# EAGLE schematic Atmoscan-ng (EAGLE 7.5.0)
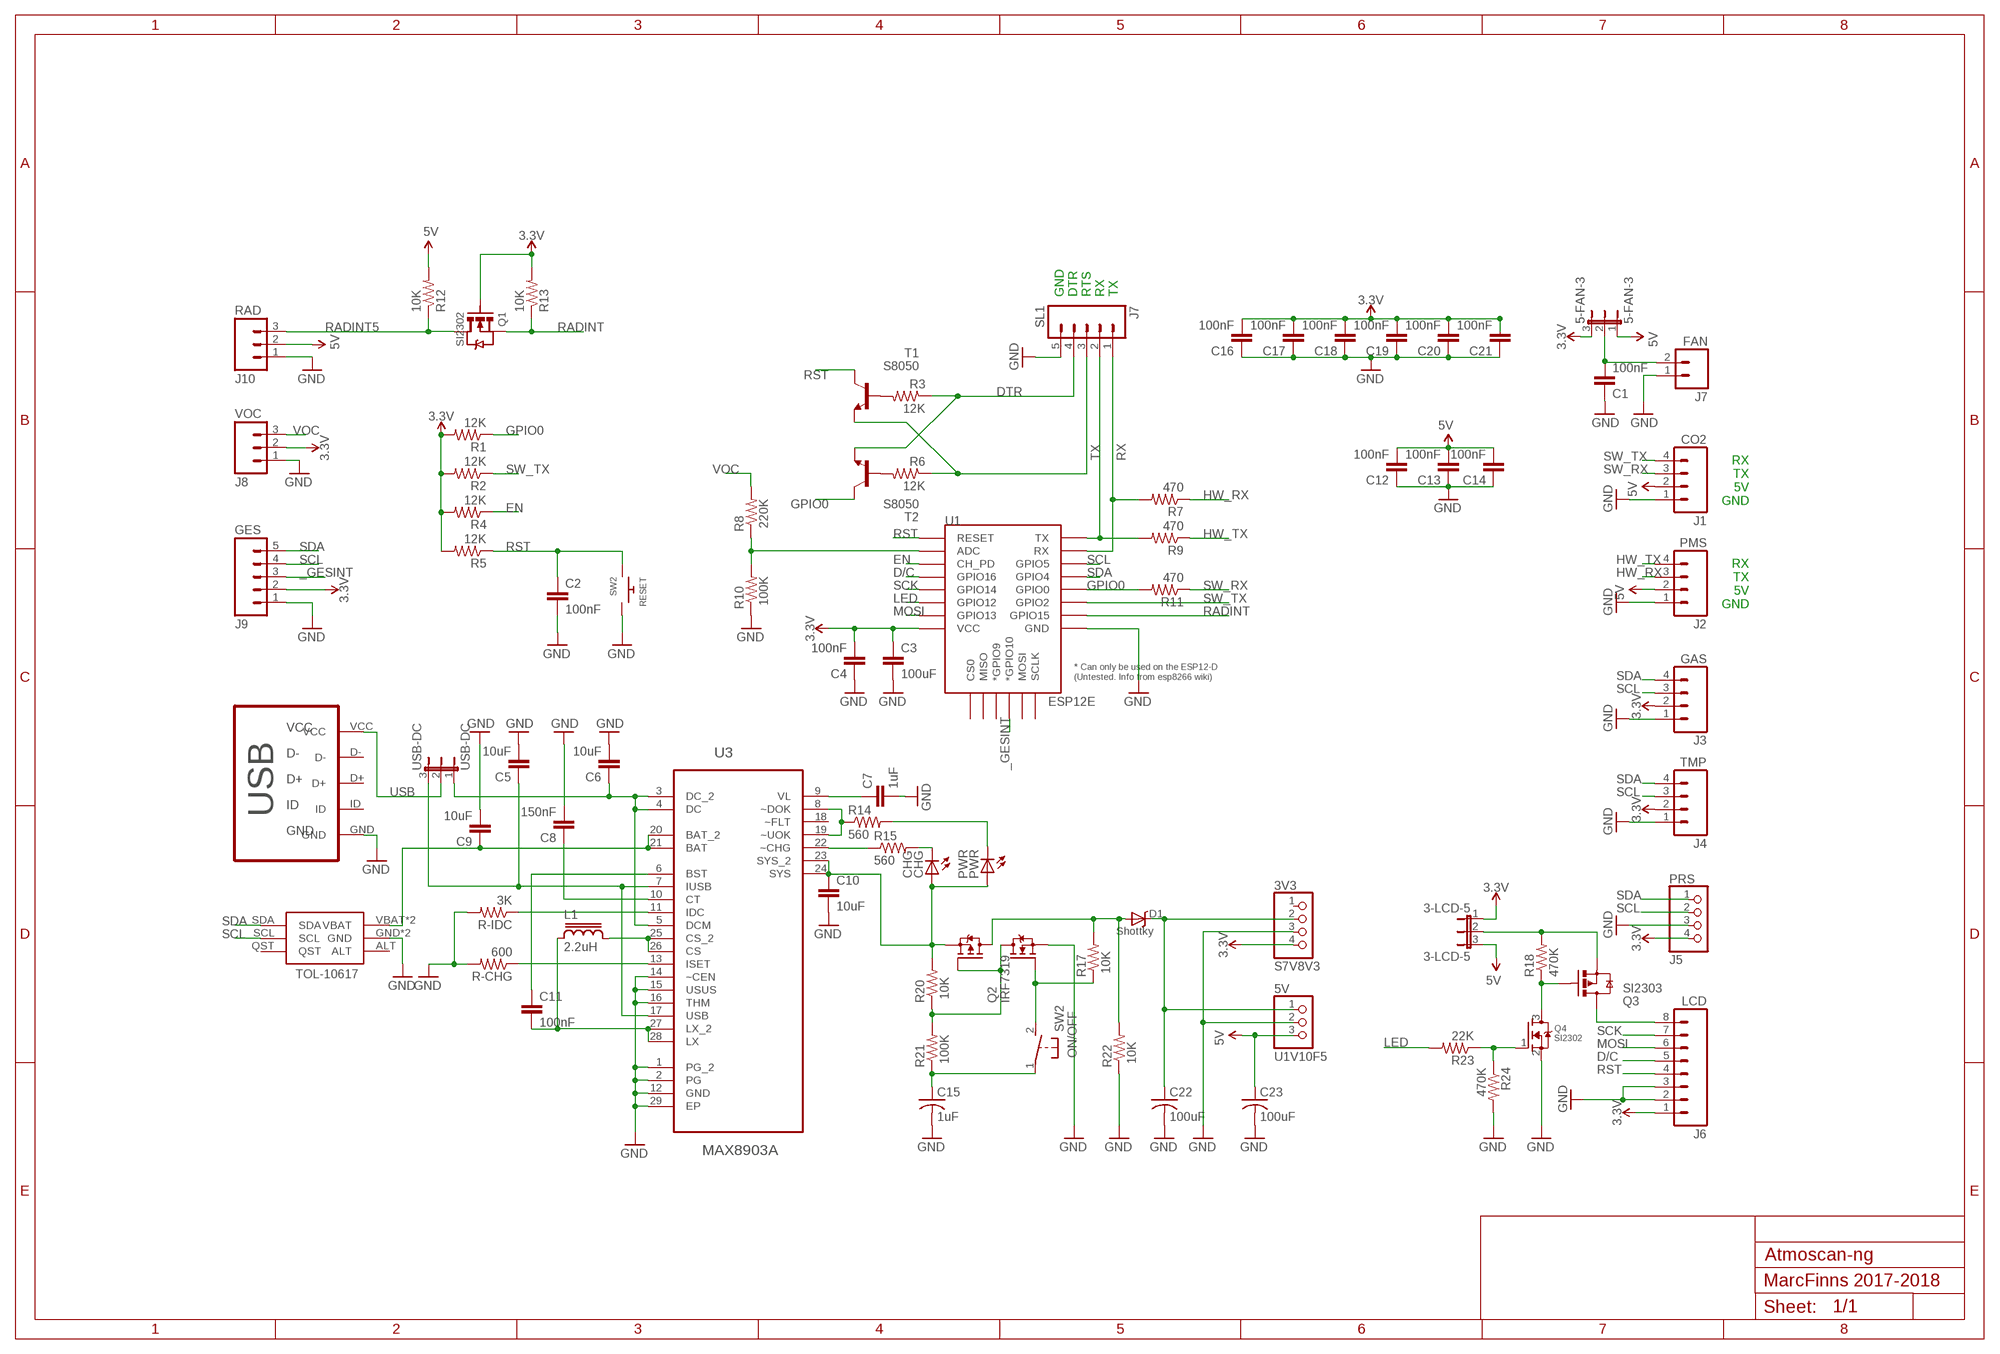
[diagram p0: schematic, sheet 1]

## Parts
3-LCD-5  3-LCD-5  JP2E  [JP2]
3V3  S7V8V3  PINHD-1X4  [1X04]
5-FAN-3  5-FAN-3  JP2E  [JP2]
5V  U1V10F5  PINHD-1X3  [1X03]
C1  100nF  C-EUC0805  [C0805]
C2  100nF  C-EUC0805  [C0805]
C3  100uF  C-EUC0805  [C0805]
C4  100nF  C-EUC0805  [C0805]
C5  10uF  C-EUC0805  [C0805]
C6  10uF  C-EUC0805  [C0805]
C7  1uF  C-EUC0805  [C0805]
C8  150nF  C-EUC0805  [C0805]
C9  10uF  C-EUC0805  [C0805]
C10  10uF  C-EUC0805  [C0805]
C11  100nF  C-EUC0805  [C0805]
C12  100nF  C-EUC0805  [C0805]
C13  100nF  C-EUC0805  [C0805]
C14  100nF  C-EUC0805  [C0805]
C15  1uF  C-USC0805K  [C0805K]
C16  100nF  C-EUC0805  [C0805]
C17  100nF  C-EUC0805  [C0805]
C18  100nF  C-EUC0805  [C0805]
C19  100nF  C-EUC0805  [C0805]
C20  100nF  C-EUC0805  [C0805]
C21  100nF  C-EUC0805  [C0805]
C22  100uF  C-USC0805K  [C0805K]
C23  100uF  C-USC0805K  [C0805K]
CHG  CHG  LEDCHIPLED_0805  [CHIPLED_0805]
CO2  J1  M04  [04P]
D1  Shottky  DIODE-SCHOTTKYSMA-403D  [SMA-403D]
FAN  J7  M02  [02P]
GAS  J3  M04  [04P]
GES  J9  M05  [05P]
L1  2.2uH  SDR0503  [SDR0503]
LCD  J6  M08  [08P]
ON/OFF  SW2  31-XX  [B3F-31XX]
PMS  J2  M04  [04P]
PRS  J5  PINHD-1X4  [1X04]
PWR  PWR  LEDCHIPLED_0805  [CHIPLED_0805]
Q1  SI2302  FET-NMOS-BSS138  [SOT-23]
Q2  IRF7319  [SO08-IRF]
Q3  SI2303  NX3008PBK  [SOT23-3]
Q4  SI2302  MOSFET-NREFLOW  [SOT23]
R1  12K  R-US_M0805  [M0805]
R2  12K  R-US_M0805  [M0805]
R3  12K  R-US_M0805  [M0805]
R4  12K  R-US_M0805  [M0805]
R5  12K  R-US_M0805  [M0805]
R6  12K  R-US_M0805  [M0805]
R7  470  R-US_M0805  [M0805]
R8  220K  R-US_M0805  [M0805]
R9  470  R-US_M0805  [M0805]
R10  100K  R-US_M0805  [M0805]
R11  470  R-US_M0805  [M0805]
R12  10K  R-US_M0805  [M0805]
R13  10K  R-US_M0805  [M0805]
R14  560  R-US_M0805  [M0805]
R15  560  R-US_M0805  [M0805]
R17  10K  R-US_M0805  [M0805]
R18  470K  R-US_M0805  [M0805]
R20  10K  R-US_M0805  [M0805]
R21  100K  R-US_M0805  [M0805]
R22  10K  R-US_M0805  [M0805]
R23  22K  R-US_M0805  [M0805]
R24  470K  R-US_M0805  [M0805]
R-CHG  600  R-US_M0805  [M0805]
R-IDC  3K  R-US_M0805  [M0805]
RAD  J10  M03  [03P]
RESET  SW2  SWITCH_PUSHBUTTONC&K_KSS  [BTN_CK_KSS]
SL1  J7  M05  [05P]
T1  S8050  BC846  [SOT23]
T2  S8050  BC846  [SOT23]
TMP  J4  M04  [04P]
U1  ESP12E  ESP12ESMD  [ESP12E-SMD]
U2  TOL-10617  [TOL-10617]
U3  MAX8903A  MAX8903AETI+  [QFN40P400X400X80-29N]
USB  MICRO-USB-B  [MICRO_USB_4_LEGS]
USB-DC  USB-DC  JP2E  [JP2]
VOC  J8  M03  [03P]

## Nets
3.3V: 3-LCD-5.1 3V3.4 5-FAN-3.3 C3.1 C4.2 C16.2 C17.2 C18.2 C19.2 C20.2 C21.2 GAS.2 GES.2 LCD.1 PRS.4 Q1.1(G) R1.2 R2.2 R4.2 R5.2 R13.2 TMP.2 U1.VCC VOC.2
5V: 3-LCD-5.3 5-FAN-3.1 5V.3 C12.2 C13.2 C14.2 C23.1 CO2.2 PMS.2 R12.2 RAD.2
_GESINT: GES.3 U1.GPIO10(*GPIO10)
ADC: R8.1 R10.2 U1.ADC
D/C: LCD.5 U1.GPIO16
DTR: R3.1 SL1.4 T2.2(E)
EN: R4.1 U1.CH_PD
GND: 3V3.3 5V.2 C1.1 C2.2 C3.2 C4.1 C5.2 C6.2 C7.2 C8.2 C9.2 C10.2 C12.1 C13.1 C14.1 C15.2 C16.1 C17.1 C18.1 C19.1 C20.1 C21.1 C22.2 C23.2 CO2.1 FAN.1 GAS.1 GES.1 LCD.2 LCD.3 PMS.1 PRS.3 Q2.1(N-S) Q4.2(S) R10.1 R22.1 R24.2 R-CHG.2 R-IDC.2 RAD.1 RESET.P$2 SL1.5 TMP.1 U1.GND U2.GND U2.GND1(GND) U3.1(PG_2) U3.2(PG) U3.12(GND) U3.14(~CEN) U3.15(USUS) U3.16(THM) U3.29(EP) USB.GND VOC.1
GPIO0: R1.1 R11.2 T2.3(C) U1.GPIO0
HW_RX: PMS.3 R7.1
HW_TX: PMS.4 R9.1
LED: R23.2 U1.GPIO12
MOSI: LCD.6 U1.GPIO13
N$1 [power]: 3-LCD-5.2 Q3.2(S) R18.2
N$3 [hipower]: LCD.8 Q3.3(D)
N$4: C15.1 ON/OFF.1(P) R21.1
N$5: C11.2 L1.1 U3.27(LX_2) U3.28(LX)
N$6: C11.1 U3.6(BST)
N$7: C8.1 U3.10(CT)
N$8: Q3.1(G) Q4.3(D) R18.1
N$9: R14.1 U3.8(~DOK) U3.19(~UOK)
N$10: C7.1 U3.9(VL)
N$11: R6.2 T2.1(B)
N$12 [hipower]: D1.A Q2.5(P-D) Q2.6(P-D) R17.2 R22.2
N$13: ON/OFF.2(S) Q2.2(N-G) R17.1
N$14: Q4.1(G) R23.1 R24.1
N$15: R15.1 U3.22(~CHG)
N$16: PWR.C R14.2
N$17: CHG.C R15.2
N$18: L1.2 U3.25(CS_2) U3.26(CS)
N$19: R-CHG.1 U3.13(ISET)
N$20: R-IDC.1 U3.11(IDC)
N$22: R3.2 T1.1(B)
N$23: 5-FAN-3.2 C1.2 FAN.2
N$26: Q2.4(P-G) Q2.7(N-D) Q2.8(N-D) R20.1 R21.2
RADINT: Q1.2(S) R13.1 U1.GPIO15
RADINT5: Q1.3(D) R12.1 RAD.3
RST: C2.1 LCD.4 R5.1 RESET.P$1 T1.3(C) U1.RESET
RTS: R6.1 SL1.3 T1.2(E)
RX: R7.2 SL1.1 U1.RXD0(RX)
SCK: LCD.7 U1.GPIO14
SCL: GAS.3 GES.4 PRS.2 TMP.3 U1.GPIO5 U2.SCL
SDA: GAS.4 GES.5 PRS.1 TMP.4 U1.GPIO4 U2.SDA
SW_RX: CO2.3 R11.1
SW_TX: CO2.4 R2.1 U1.GPIO2
SYS: C10.1 CHG.A PWR.A Q2.3(P-S) R20.2 U3.23(SYS_2) U3.24(SYS)
TX: R9.2 SL1.2 U1.TXD0(TX)
USB: USB-DC.2 USB.VCC
VBAT [hipower]: C9.1 U2.VBAT U2.VBAT1(VBAT) U3.20(BAT_2) U3.21(BAT)
VDC: C6.1 U3.3(DC_2) U3.4(DC) U3.5(DCM) USB-DC.1
VOC: R8.2 VOC.3
VUNREG [hipower]: 3V3.2 5V.1 C22.1 D1.C
VUSB [power]: C5.1 U3.7(IUSB) U3.17(USB) USB-DC.3
Unconnected: 3V3.1 U1.CS0 U1.GPIO9(*GPIO9) U1.MISO U1.MOSI U1.SCLK U2.ALT U2.QST U3.18(~FLT) USB.D+ USB.D- USB.ID

## Notes on the sheet
- GND
  DTR
  RTS
  RX
  TX
- RX
  TX
  5V
  GND
- RX
  TX
  5V
  GND
- MarcFinns 2017-2018

## Library data of the parts
3-LCD-5 5-FAN-3 USB-DC = jumper:JP2E: JUMPER
3V3 PRS = pinhead:PINHD-1X4: PIN HEADER
5V = pinhead:PINHD-1X3: PIN HEADER
C1-C14 C16-C21 = rcl:C-EU: CAPACITOR, European symbol
C15 C22 C23 = adafruit:C-US: CAPACITOR, American symbol
CHG PWR = adafruit:LED: LED OSRAM: - CHIPLED LG R971, LG N971, LY N971, LG Q971, LY Q971, LO R971, LY R971 LH N974, LH R974 LS Q976, LO Q976, LY Q976 LO Q996 - Hyper CHIPLED LW Q18S LB Q993, LB Q99A, LB R99A - SideLED LS A670, LO A670, LY A670, LG A670, LP A670 LB A673, LV A673, LT A673, LW A673 LH A674 LY A675 LS A676, LA A676, LO A676, LY A676, LW A676 LS A679, LY A679, LG A679 - Hyper Micro SIDELED® LS Y876, LA Y876, LO Y876, LY Y876 LT Y87S - SmartLED LW L88C, LW L88S LB L89C, LB L89S, LG L890 LS L89K, LO L89K, LY L89K LS L896, LA L896, LO L896, LY L896 - TOPLED LS T670, LO T670, LY T670, LG T670, LP T670 LSG T670, LSP T670, LSY T670, LOP T670, LYG T670 LG T671, LOG T671, LSG T671 LB T673, LV T673, LT T673, LW T673 LH T674 LS T676, LA T676, LO T676, LY T676, LB T676, LH T676, LSB T676, LW T676 LB T67C, LV T67C, LT T67C, LS T67K, LO T67K, LY T67K, LW E67C LS E67B, LA E67B, LO E67B, LY E67B, LB E67C, LV E67C, LT E67C LW T67C LS T679, LY T679, LG T679 LS T770, LO T770, LY T770, LG T770, LP T770 LB T773, LV T773, LT T773, LW T773 LH T774 LS E675, LA E675, LY E675, LS T675 LS T776, LA T776, LO T776, LY T776, LB T776 LHGB T686 LT T68C, LB T68C - Hyper Mini TOPLED® LB M676 - Mini TOPLED Santana® LG M470 LS M47K, LO M47K, LY M47K Source: http://www.osram.convergy.de/
CO2 GAS PMS TMP = con-amp-quick:M04: AMP QUICK CONNECTOR; OC_FARNELL: unknown; OC_NEWARK: unknown
D1 = Ai_DiscreteSemis:DIODE-SCHOTTKY: Commonly MBRA140.
FAN = con-amp-quick:M02: AMP QUICK CONNECTOR; OC_FARNELL: unknown; OC_NEWARK: unknown
GES SL1 = con-amp-quick:M05: AMP QUICK CONNECTOR; OC_FARNELL: unknown; OC_NEWARK: unknown
L1 = inductor-bourns:SDR0503: POWER INDUCTOR
LCD = con-amp-quick:M08: AMP QUICK CONNECTOR; OC_FARNELL: unknown; OC_NEWARK: unknown
ON/OFF = switch-omron:31-XX: OMRON SWITCH; MPN: B3F-3100; OC_FARNELL: 959704; OC_NEWARK: 36M3582
Q1 = Ai_DiscreteSemis:FET-NMOS
Q2 = lio:IRF7319: Complimentary Half Bridge HEXFET Power MOSFET Source: http://www.irf.com/product-info/datasheets/data/irf7319.pdf
Q3 = fets:NX3008PBK: MOSFET - P Channel; DIGIKEY: 568-10499-1-ND; MOUSER: 771-NX3008PBK,215; NEWARK: 74T4665
Q4 = adafruit:MOSFET-N: N-Channel Mosfet 2N7002E - 60V 260mA SOT23 [Digikey: 2N7002ET1GOSTR-ND] - REEL BSH103 - 30V 850mA SOT23 [Digikey: 568-5013-1-ND]
R1-R15 R17 R18 R20-R24 R-CHG R-IDC = adafruit:R-US_: RESISTOR, American symbol
RAD VOC = con-amp-quick:M03: AMP QUICK CONNECTOR; OC_FARNELL: unknown; OC_NEWARK: unknown
RESET = adafruit:SWITCH_PUSHBUTTON: Buttons SOFTTOUCHSMD_SJ - Soft touch temporary push button (Super Junk Akihabara) Compatible with SKPMANE010 [Mouser: 688-SKPMAN] C&K_KSS = Digikey: KSS221GLFS
T1 T2 = transistor:BC846: NPN TRANSISTOR
U1 = esp8266modules:ESP12E: ESP12E Module
U2 = Marcello:TOL-10617
U3 = Maxim_By_element14_Batch_1:MAX8903AETI+: 2A 1-Cell Li+ DC-DC Chargers for USB and Adapter Power; MPN: MAX8903AETI+; OC_FARNELL: 1813114; OC_NEWARK: 71P2395; PACKAGE: TQFN-28; SUPPLIER: Maxim
USB = micro usb B - 4LEGS:MICRO-USB-B

## Net classes
1 power: width 0.61 mm
2 hipower: width 0.813 mm